# Altium schematic sheet [26] PWR 3V3, 1V0_CON.SchDoc
size 386 x 246 mm; DocumentNumber: 26; SheetNumber: 26; SheetTotal: 33
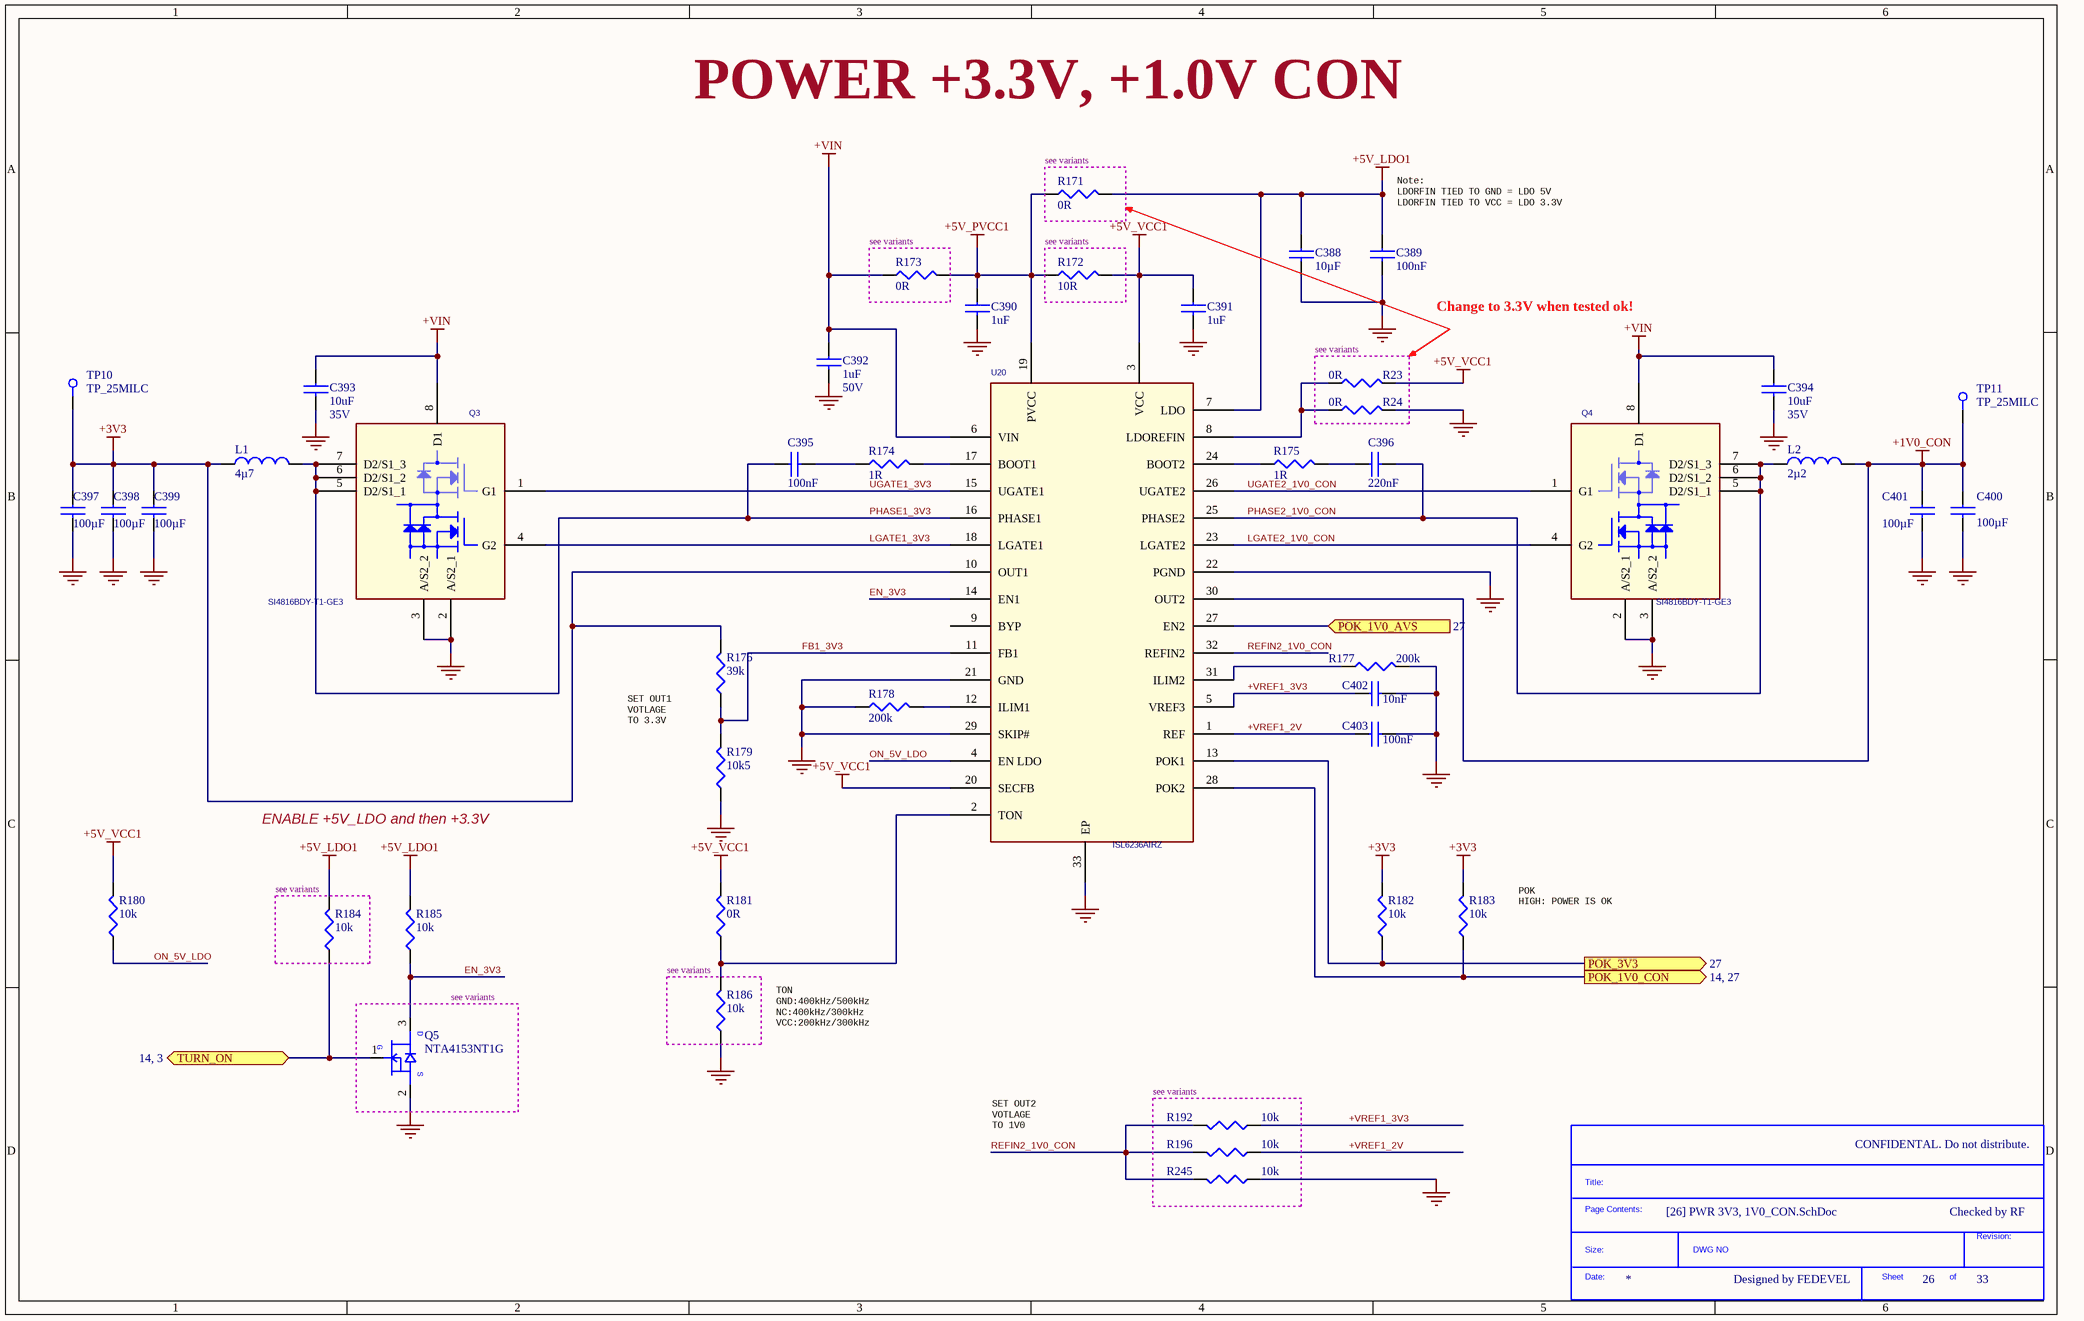
[diagram p0: [26] PWR 3V3, 1V0_CON.SchDoc]

## Parts
*  SDTitleBlock  (value not drawn)  (graphical)
C388  10µF  [C0603]
C389  100nF  [C0402]
C390  1uF  [C0402]
C391  1uF  [C0402]
C392  1uF  Voltage - Rated: 50V  [C0805]
C393  10uF  Voltage - Rated: 35V  [C1206]
C394  10uF  Voltage - Rated: 35V  [C1206]
C395  100nF  [C0402]
C396  220nF  [C0402]
C397  100µF  [C1206]
C398  100µF  [C1206]
C399  100µF  [C1206]
C400  100µF  [C1206]
C401  100µF  [C1206]
C402  10nF  [C0402]
C403  100nF  [C0402]
L1  4µ7  [IHLP_255MILx270MIL]
L2  2µ2  [IHLP_255MILx270MIL]
Q3  SI4816BDY-T1-GE3  [8_SOIC_3.9MM]
Q4  SI4816BDY-T1-GE3  [8_SOIC_3.9MM]
Q5  NTA4153NT1G  [SC-75_SOT-416]
R23  0R  [R0402]
R24  0R  [R0402]
R171  0R  [R0402]
R172  10R  [R0402]
R173  0R  [R0402]
R174  1R  [R0402]
R175  1R  [R0402]
R176  39k  [R0402]
R177  200k  [R0402]
R178  200k  [R0402]
R179  10k5  [R0402]
R180  10k  [R0402]
R181  0R  [R0402]
R182  10k  [R0402]
R183  10k  [R0402]
R184  10k  [R0402]
R185  10k  [R0402]
R186  10k  [R0402]
R192  10k  [R0402]
R196  10k  [R0402]
R245  10k  [R0402]
TP10  TP_25MILC  [TP_25C]  (no BOM)
TP11  TP_25MILC  [TP_25C]  (no BOM)
U20  ISL6236AIRZ  [32_VFQFN_EXPOSED_PAD]

## Blocks framed on the sheet
see variants: R171
see variants: R173
see variants: R172
see variants: R23 R24
see variants: R184
see variants: Q5
see variants: R186
see variants: R192 R196 R245

## Ports
POK_1V0_AVS (in, see 27), POK_1V0_CON (out, see 14, 27), POK_3V3 (out, see 27), TURN_ON (see 14, 3)

## Nets
+1V0_CON: C400.1 C401.1 L2.2 TP11.1 U20.30(OUT2)
+3V3: C397.1 C398.1 C399.1 L1.1 R176.2 R182.2 R183.2 TP10.1 U20.10(OUT1)
+5V_LDO1: C388.1 C389.1 R171.2 R184.2 R185.2 U20.7(LDO)
+5V_PVCC1: C390.1 R171.1 R172.1 R173.2 U20.19(PVCC)
+5V_VCC1: C391.1 R23.2 R172.2 R180.2 R181.2 U20.3(VCC) U20.20(SECFB)
+VIN: C392.1 C393.1 C394.1 Q3.8(D1) Q4.8(D1) R173.1 U20.6(VIN)
GND: C388.2 C389.2 C390.2 C391.2 C392.2 C393.2 C394.2 C397.2 C398.2 C399.2 C400.2 C401.2 C402.2 C403.2 Q3.2(A/S2_1) Q3.3(A/S2_2) Q4.2(A/S2_1) Q4.3(A/S2_2) Q5.2(SOURCE) R24.2 R177.2 R178.1 R179.1 R186.1 R245.1 U20.21(GND) U20.22(PGND) U20.29(SKIP#) U20.33(EP)
+VREF1_2V: C403.1 R196.1 U20.1(REF)
+VREF1_3V3: C402.1 R192.1 U20.5(VREF3)
EN_3V3: Q5.3(DRAIN) R185.1 U20.14(EN1)
FB1_3V3: R176.1 R179.2 U20.11(FB1)
LGATE1_3V3: Q3.4(G2) U20.18(LGATE1)
LGATE2_1V0_CON: Q4.4(G2) U20.23(LGATE2)
ON_5V_LDO: R180.1 U20.4(EN_LDO)
PHASE1_3V3: C395.1 L1.2 Q3.5(D2/S1_1) Q3.6(D2/S1_2) Q3.7(D2/S1_3) U20.16(PHASE1)
PHASE2_1V0_CON: C396.2 L2.1 Q4.5(D2/S1_1) Q4.6(D2/S1_2) Q4.7(D2/S1_3) U20.25(PHASE2)
POK_1V0_AVS: U20.27(EN2) ; port POK_1V0_AVS
POK_1V0_CON: R183.1 U20.28(POK2) ; port POK_1V0_CON
POK_3V3: R182.1 U20.13(POK1) ; port POK_3V3
REFIN2_1V0_CON: R192.2 R196.2 R245.2 U20.32(REFIN2)
TURN_ON: Q5.1(GATE) R184.1 ; port TURN_ON
UGATE1_3V3: Q3.1(G1) U20.15(UGATE1)
UGATE2_1V0_CON: Q4.1(G1) U20.26(UGATE2)
NetC395_2: C395.2 R174.1
NetC396_1: C396.1 R175.2
NetR23_1: R23.1 R24.1 U20.8(LDOREFIN)
NetR174_2: R174.2 U20.17(BOOT1)
NetR175_1: R175.1 U20.24(BOOT2)
NetR177_1: R177.1 U20.31(ILIM2)
NetR178_2: R178.2 U20.12(ILIM1)
NetR181_1: R181.1 R186.2 U20.2(TON)

Not connected (* = marked no-connect by the designer): U20 9(BYP)

## Notes on the sheet
- POWER +3.3V, +1.0V CON
- (near C389) Note:
  LDORFIN TIED TO GND = LDO 5V
  LDORFIN TIED TO VCC = LDO 3.3V
- Change to 3.3V when tested ok!
- SET OUT1
  VOTLAGE
  TO 3.3V
- ENABLE +5V_LDO and then +3.3V
- POK
  HIGH: POWER IS OK
- TON
  GND:400kHz/500kHz
  NC:400kHz/300kHz
  VCC:200kHz/300kHz
- SET OUT2
  VOTLAGE
  TO 1V0
- CONFIDENTAL. Do not distribute.
- Checked by RF
- Designed by FEDEVEL
- (in symbol NTA4153NT1G) D; G; S
- (in symbol SDTitleBlock) Title:; Page Contents:; Revision:; Size:; DWG NO; Date:; Sheet; of

## Library data of the parts
C388 = C1608X5R0J106M: CAP CER 10UF 6.3V X5R 20% 0603; Manufacturer: TDK Corporation; .Checked PCB: used; Description: CAP CER 10UF 6.3V 20% X5R 0603; Capacitance: 10µF; Category: Capacitors; Manufacturer Part Number: C1608X5R0J106M; Operating Temperature: -55°C ~ 85°C; Package / Case: 0603 (1608 Metric); Price 1k [$]: 0.08580; Value: 10µF; .Checked SCH: used; Voltage - Rated: 6.3V; Features: Low ESR; Supplier Part Number: 445-4112-1-ND; Supplier: Digikey; Supplier 1: Digi-Key; Supplier Part Number 1: 445-4112-1-ND; RoHS: RoHS Compliant; Stock 1: 48157; Pricing 1: 1=0.46, 10=0.363, 100=0.1898, 250=0.14024, 500=0.1089, 1000=0.0858 (USD); Tolerance: ±20%; Temperature Coefficient: X5R; Mounting Type: Surface Mount, MLCC; Applications: General Purpose; Ratings: -; Size / Dimension: 0.063" L x 0.031" W (1.60mm x 0.80mm); Height - Seated (Max): -; Thickness (Max): 0.037" (0.95mm); Lead Spacing: -; Packaging: Cut Tape (CT); Lead Style: -; ComponentLink1URL: http://www.tdk.com/pdf/general_B11.pdf; ComponentLink1Description: http://www.tdk.com/pdf/general_B11.pdf
C389 C395 C403 = C1005X5R1H104K: CAP CER .10UF 50V X5R 10% 0402; Manufacturer: TDK Corporation; Capacitance: 0.1µF; .Checked PCB: used; Description: CAP CER 0.1UF 50V 10% X5R 0402; Category: Capacitors; Manufacturer Part Number: C1005X5R1H104K; Operating Temperature: -55°C ~ 85°C; Package / Case: 0402 (1005 Metric); Price 1k [$]: 0.02340; Value: 100nF; .Checked SCH: used; Voltage - Rated: 50V; Supplier Part Number: 445-5942-1-ND; Supplier: Digikey; Supplier 1: Digi-Key; Supplier Part Number 1: 445-5942-1-ND; RoHS: RoHS Compliant; Stock 1: 106926; Pricing 1: 1=0.27, 10=0.18, 100=0.072, 250=0.05176, 500=0.0369, 1000=0.027 (USD); Tolerance: ±10%; Temperature Coefficient: X5R; Mounting Type: Surface Mount, MLCC; Applications: General Purpose; Ratings: -; Size / Dimension: 0.039" L x 0.020" W (1.00mm x 0.50mm); Height - Seated (Max): -; Thickness (Max): 0.022" (0.55mm); Lead Spacing: -; Features: -; Packaging: Cut Tape (CT); Lead Style: -; ComponentLink1URL: http://www.tdk.co.jp/tefe02/e412_c.pdf; ComponentLink1Description: http://www.tdk.co.jp/tefe02/e412_c.pdf
C390 C391 = C1005X5R1C105K: CAP CER 1.0UF 16V X5R 0402; Manufacturer: TDK Corporation; Capacitance: 1.0µF; .Checked PCB: used; Description: CAP CER 1UF 16V 10% X5R 0402; Tolerance: ±10%; Category: Capacitors; Manufacturer Part Number: C1005X5R1C105K; Operating Temperature: -55°C ~ 85°C; Package / Case: 0402 (1005 Metric); Price 1k [$]: 0.02080; Value: 1uF; .Checked SCH: used; Voltage - Rated: 16V; Supplier Part Number: 445-4978-1-ND; Supplier: Digikey; Supplier 1: Digi-Key; Supplier Part Number 1: 445-4978-1-ND; RoHS: RoHS Compliant; Stock 1: 341010; Pricing 1: 1=0.24, 10=0.16, 100=0.064, 250=0.046, 500=0.0328, 1000=0.024 (USD); Temperature Coefficient: X5R; Mounting Type: Surface Mount, MLCC; Applications: General Purpose; Ratings: -; Size / Dimension: 0.039" L x 0.020" W (1.00mm x 0.50mm); Height - Seated (Max): -; Thickness (Max): 0.022" (0.55mm); Lead Spacing: -; Features: -; Packaging: Cut Tape (CT); Lead Style: -; ComponentLink1URL: http://www.tdk.co.jp/tefe02/e412_c.pdf; ComponentLink1Description: http://www.tdk.co.jp/tefe02/e412_c.pdf
C392 = GRM21BR71H105KA12L: CAP CER 1UF 50V X7R 0805; Manufacturer: Murata Electronics North America; Capacitance: 1.0µF; .Checked PCB: used; Description: CAP CER 1UF 50V 10% X7R 0805; Tolerance: ±10%; Category: Capacitors; Manufacturer Part Number: GRM21BR71H105KA12L; Operating Temperature: -55°C ~ 125°C; Package / Case: 0805 (2012 Metric); Price 1k [$]: 0.1359; Value: 1uF; .Checked SCH: used; Supplier Part Number: 490-4736-1-ND; Supplier: Digikey; Supplier 1: Digi-Key; Supplier Part Number 1: 490-4736-1-ND; RoHS: RoHS Compliant; Stock 1: 422791; Pricing 1: 1=0.28, 10=0.254, 25=0.226, 50=0.1978, 100=0.1836, 250=0.16952, 500=0.16102, 750=0.14691, 1000=0.12995 (USD); Temperature Coefficient: X7R; Mounting Type: Surface Mount, MLCC; Applications: General Purpose; Ratings: -; Size / Dimension: 0.079" L x 0.049" W (2.00mm x 1.25mm); Height - Seated (Max): -; Thickness (Max): 0.053" (1.35mm); Lead Spacing: -; Features: -; Packaging: Cut Tape (CT); Lead Style: -; ComponentLink1URL: http://search.murata.co.jp/Ceramy/image/img/PDF/ENG/GRM21BR71H105KA12.pdf; ComponentLink1Description: http://search.murata.co.jp/Ceramy/image/img/PDF/ENG/GRM21BR71H105KA12.pdf
C393 C394 = GRM31CR6YA106KA12L: CAP CER 10UF 35V X5R 1206; Manufacturer: Murata Electronics North America; Capacitance: 10µF; .Checked PCB: used; Description: CAP CER 10UF 35V 10% X5R 1206; Tolerance: ±10%; Category: Capacitors; Manufacturer Part Number: GRM31CR6YA106KA12L; Operating Temperature: -55°C ~ 85°C; Package / Case: 1206 (3216 Metric); Price 1k [$]: 0.19448; Value: 10uF; .Checked SCH: used; Supplier Part Number: 490-5524-1-ND; Supplier: Digikey; Supplier 1: Digi-Key; Supplier Part Number 1: 490-5524-1-ND; RoHS: RoHS Compliant; Stock 1: 76334; Pricing 1: 1=0.6, 10=0.501, 50=0.359, 100=0.3142, 250=0.24684, 500=0.2244, 1000=0.17952 (USD); Temperature Coefficient: X5R; Mounting Type: Surface Mount, MLCC; Applications: General Purpose; Ratings: -; Size / Dimension: 0.126" L x 0.063" W (3.20mm x 1.60mm); Height - Seated (Max): -; Thickness (Max): 0.071" (1.80mm); Lead Spacing: -; Features: -; Packaging: Cut Tape (CT); Lead Style: -; ComponentLink1URL: http://www.murata.com/products/catalog/pdf/c02e.pdf; ComponentLink1Description: http://www.murata.com/products/catalog/pdf/c02e.pdf
C396 = C1005X5R1E224M: CAP CER .22UF 25V X5R 20% 0402; Manufacturer: TDK Corporation; Capacitance: 0.22µF; .Checked PCB: used; Description: CAP CER 0.22UF 25V 20% X5R 0402; Category: Capacitors; Manufacturer Part Number: C1005X5R1E224M; Operating Temperature: -55°C ~ 85°C; Package / Case: 0402 (1005 Metric); Price 1k [$]: 0.02600; Value: 220nF; .Checked SCH: used; Voltage - Rated: 25V; Supplier Part Number: 445-5945-1-ND; Supplier: Digikey; Supplier 1: Digi-Key; Supplier Part Number 1: 445-5945-1-ND; RoHS: RoHS Compliant; Stock 1: 54593; Pricing 1: 1=0.3, 10=0.2, 100=0.08, 250=0.05752, 500=0.041, 1000=0.03 (USD); Tolerance: ±20%; Temperature Coefficient: X5R; Mounting Type: Surface Mount, MLCC; Applications: General Purpose; Ratings: -; Size / Dimension: 0.039" L x 0.020" W (1.00mm x 0.50mm); Height - Seated (Max): -; Thickness (Max): 0.022" (0.55mm); Lead Spacing: -; Features: -; Packaging: Cut Tape (CT); Lead Style: -; ComponentLink1URL: http://www.tdk.co.jp/tefe02/e412_c.pdf; ComponentLink1Description: http://www.tdk.co.jp/tefe02/e412_c.pdf
C397-C401 = C3216X5R1A107M: CAP CER 100UF 10V X5R 20% 1206; Manufacturer: TDK Corporation; .Checked PCB: used; Description: CAP CER 100UF 10V 20% X5R 1206; Capacitance: 100µF; Category: Capacitors; Manufacturer Part Number: C3216X5R1A107M; Operating Temperature: -55°C ~ 85°C; Package / Case: 1206 (3216 Metric); Price 1k [$]: 0.85800; Value: 100µF; .Checked SCH: used; Voltage - Rated: 10V; Supplier Part Number: 445-6007-1-ND; Supplier: Digikey; Supplier 1: Digi-Key; Supplier Part Number 1: 445-6007-1-ND; RoHS: RoHS Compliant; Stock 1: 28026; Pricing 1: 1=1.65, 10=1.353, 100=1.089, 250=0.957, 500=0.891, 1000=0.693 (USD); Tolerance: ±20%; Temperature Coefficient: X5R; Mounting Type: Surface Mount, MLCC; Applications: General Purpose; Ratings: -; Size / Dimension: 0.126" L x 0.063" W (3.20mm x 1.60mm); Height - Seated (Max): -; Thickness (Max): 0.071" (1.80mm); Lead Spacing: -; Features: -; Packaging: Cut Tape (CT); Lead Style: -; ComponentLink1URL: http://www.tdk.com/pdf/general_B11.pdf; ComponentLink1Description: http://www.tdk.com/pdf/general_B11.pdf
C402 = C1005X7R1C103K: CAP CER 10000PF 16V X7R 10% 0402; Manufacturer: TDK Corporation; .Checked PCB: used; Description: CAP CER 10000PF 16V 10% X7R 0402; Capacitance: 10000pF; Category: Capacitors; Manufacturer Part Number: C1005X7R1C103K; Operating Temperature: -55°C ~ 125°C; Package / Case: 0402 (1005 Metric); Price 1k [$]: 0.00416; Value: 10nF; .Checked SCH: used; Voltage - Rated: 16V; Supplier Part Number: 445-1262-1-ND; Supplier: Digikey; Supplier 1: Digi-Key; Supplier Part Number 1: 445-1262-1-ND; RoHS: RoHS Compliant; Stock 1: 511497; Pricing 1: 1=0.08, 10=0.05, 100=0.018, 250=0.013, 500=0.0096, 1000=0.0065 (USD); Tolerance: ±10%; Temperature Coefficient: X7R; Mounting Type: Surface Mount, MLCC; Applications: General Purpose; Ratings: -; Size / Dimension: 0.039" L x 0.020" W (1.00mm x 0.50mm); Height - Seated (Max): -; Thickness (Max): 0.022" (0.55mm); Lead Spacing: -; Features: -; Packaging: Cut Tape (CT); Lead Style: -; ComponentLink1URL: http://www.tdk.co.jp/tefe02/e412_c.pdf; ComponentLink1Description: http://www.tdk.co.jp/tefe02/e412_c.pdf
L1 = IHLP2525CZER4R7M01: INDUCTOR POWER 4.7UH 5.5A SMD; Manufacturer: Vishay/Dale; .Checked PCB: used; Inductance: 4.7µH; Current - Saturation: 10A; Shielding: Shielded; DC Resistance (DCR): 40 mOhm Max; Tolerance: ±20%; Frequency - Test: 100kHz; .Checked SCH: used; Category: Inductors, Coils, Chokes; Manufacturer Part Number: IHLP2525CZER4R7M01; Operating Temperature: -55°C ~ 125°C; Package / Case: 0.270" L x 0.255" W x 0.118" H (6.86mm x 6.47mm x 3.00mm); Price 1k [$]: 1.09800; Value: 4µ7; Current: 5.5A; Applications: General Purpose; Supplier Part Number: 541-1010-1-ND; Supplier: Digikey; Supplier 1: Digi-Key; Supplier Part Number 1: 541-1010-1-ND; RoHS: RoHS Compliant; Stock 1: 25684; Pricing 1: 1=2.26, 10=1.83, 100=1.525, 500=1.22, 1000=1.098 (USD); Current - Temperature Rise: 5.5A; Type: -; Q @ Freq: -; Frequency - Self Resonant: -; Material - Core: -; Mounting Type: Surface Mount; Packaging: Cut Tape (CT); ComponentLink1URL: http://www.vishay.com/doc?34104; ComponentLink1Description: http://www.vishay.com/doc?34104
L2 = IHLP2525CZER2R2M01: INDUCTOR POWER 2.2UH 8A SMD; Manufacturer: Vishay/Dale; .Checked PCB: used; Inductance: 2.2µH; Current - Saturation: 14A; Shielding: Shielded; DC Resistance (DCR): 20 mOhm Max; Tolerance: ±20%; Frequency - Test: 100kHz; .Checked SCH: used; Category: Inductors, Coils, Chokes; Manufacturer Part Number: IHLP2525CZER2R2M01; Operating Temperature: -55°C ~ 125°C; Package / Case: 0.270" L x 0.255" W x 0.118" H (6.86mm x 6.47mm x 3.00mm); Price 1k [$]: 1.09800; Value: 2µ2; Current: 8A; Applications: General Purpose; Supplier Part Number: 541-1008-1-ND; Supplier: Digikey; Supplier 1: Digi-Key; Supplier Part Number 1: 541-1008-1-ND; RoHS: RoHS Compliant; Stock 1: 17960; Pricing 1: 1=2.26, 10=1.83, 100=1.525, 500=1.22, 1000=1.098 (USD); Current - Temperature Rise: 8A; Type: -; Q @ Freq: -; Frequency - Self Resonant: -; Material - Core: -; Mounting Type: Surface Mount; Packaging: Cut Tape (CT); ComponentLink1URL: http://www.vishay.com/doc?34104; ComponentLink1Description: http://www.vishay.com/doc?34104
Q3 Q4 = SI4816BDY-T1-GE3: MOSFET DL N-CH 30V 6.8A 8-SOIC; Manufacturer: Vishay/Siliconix; .Checked PCB: used; FET Type: 2 N-Channel (Dual); FET Feature: Logic Level Gate; Rds On (Max) @ Id, Vgs: 18.5 mOhm @ 6.8A, 10V; Current - Continuous Drain (Id) @ 25° C: 5.8A, 8.2A; Vgs(th) (Max) @ Id: 3V @ 250µA; Power - Max: 1W, 1.25W; Gate Charge (Qg) @ Vgs: 10nC @ 5V; .Checked SCH: used; Category: Discrete Semiconductor Products; Manufacturer Part Number: SI4816BDY-T1-GE3; Package / Case: 8-SOIC (0.154", 3.90mm Width); Price 1k [$]: 0.84800; Value: SI4816BDY-T1-GE3; Family: FETs - Arrays; Drain to Source Voltage (Vdss): 30V; Supplier Part Number: SI4816BDY-T1-GE3CT-ND; Supplier: Digikey; Supplier 1: Digi-Key; Supplier Part Number 1: SI4816BDY-T1-GE3CT-ND; RoHS: RoHS Compliant; Stock 1: 15735; Pricing 1: 1=1.84, 25=1.4228, 100=1.2912, 250=1.1594, 500=1.0013, 1000=0.8432 (USD); Input Capacitance (Ciss) @ Vds: -; Mounting Type: Surface Mount; Supplier Device Package: 8-SOICN; Packaging: Cut Tape (CT); ComponentLink1URL: http://www.vishay.com/docs/73026/si4816bd.pdf; ComponentLink1Description: http://www.vishay.com/docs/73026/si4816bd.pdf
Q5 = NTA4153NT1G: MOSFET N-CH 20V 915MA SOT-416; Manufacturer: ON Semiconductor; .Checked PCB: used; FET Type: MOSFET N-Channel, Metal Oxide; FET Feature: Logic Level Gate; Rds On (Max) @ Id, Vgs: 230 mOhm @ 600mA, 4.5V; Vgs(th) (Max) @ Id: 1.1V @ 250µA; Power - Max: 300mW; Gate Charge (Qg) @ Vgs: 1.82nC @ 4.5V; Input Capacitance (Ciss) @ Vds: 110pF @ 16V; .Checked SCH: used; Category: Discrete Semiconductor Products; Family: FETs - Single; Manufacturer Part Number: NTA4153NT1G; Package / Case: SC-75-3, SOT-416; Price 1k [$]: 0.14710; Value: NTA4153NT1G; Drain to Source Voltage (Vdss): 20V; Current - Continuous Drain (Id) @ 25° C: 915mA; Supplier Part Number: NTA4153NT1GOSCT-ND; Supplier: Digikey; Supplier 1: Digi-Key; Supplier Part Number 1: NTA4153NT1GOSCT-ND; RoHS: RoHS Compliant; Stock 1: 35742; Pricing 1: 1=0.51, 25=0.3312, 100=0.2721, 250=0.22672, 500=0.18836, 1000=0.13952 (USD); Mounting Type: Surface Mount; Supplier Device Package: SC-75; Packaging: Cut Tape (CT); ComponentLink1URL: http://www.onsemi.com/pub_link/Collateral/NTA4153N-D.PDF; ComponentLink1Description: http://www.onsemi.com/pub_link/Collateral/NTA4153N-D.PDF
R23 R24 R171 R173 R181 = RC0402JR-070RL: RES 0.0 OHM 1/16W 0402 SMD; Manufacturer: Yageo; Resistance (Ohms): 0.0; Power (Watts): 0.063W, 1/16W; Tolerance: Jumper; .Checked PCB: used; Category: Resistors; Supplier Part Number: 311-0.0JRCT-ND; Manufacturer Part Number: RC0402JR-070RL; Package / Case: 0402 (1005 Metric); Price 1k [$]: 0.01389; Value: 0R; .Checked SCH: used; Supplier: Digikey; Supplier 1: Digi-Key; Supplier Part Number 1: 311-0.0JRCT-ND; RoHS: RoHS Compliant; Stock 1: 1106330; Pricing 1: 10=0.012, 50=0.009, 100=0.0069, 250=0.00512, 500=0.0038, 1000=0.00253 (USD); Composition: Thick Film; Features: -; Temperature Coefficient: -; Size / Dimension: 0.039" L x 0.020" W (1.00mm x 0.50mm); Height: 0.016" (0.40mm); Number of Terminations: 2; Packaging: Cut Tape (CT); ComponentLink1URL: http://www.yageo.com/documents/recent/PYu-RC0402_51_RoHS_L_6.pdf; ComponentLink1Description: http://www.yageo.com/documents/recent/PYu-RC0402_51_RoHS_L_6.pdf
R172 = RC0402FR-0710RL: RES 10.0 OHM 1/16W 1% 0402 SMD; Manufacturer: Yageo; Resistance (Ohms): 10; Power (Watts): 0.063W, 1/16W; .Checked PCB: used; Temperature Coefficient: ±200ppm/°C; Category: Resistors; Manufacturer Part Number: RC0402FR-0710RL; Package / Case: 0402 (1005 Metric); Price 1k [$]: 0.01421; Tolerance: ±1%; Value: 10R; .Checked SCH: used; Supplier Part Number: 311-10.0LRCT-ND; Supplier: Digikey; Supplier 1: Digi-Key; Supplier Part Number 1: 311-10.0LRCT-ND; RoHS: RoHS Compliant; Stock 1: 681416; Pricing 1: 10=0.014, 50=0.0104, 100=0.0079, 250=0.00584, 500=0.00432, 1000=0.00288 (USD); Composition: Thick Film; Features: -; Size / Dimension: 0.039" L x 0.020" W (1.00mm x 0.50mm); Height: 0.016" (0.40mm); Number of Terminations: 2; Packaging: Cut Tape (CT); ComponentLink1URL: http://www.yageo.com/documents/recent/PYu-RC0402_51_RoHS_L_6.pdf; ComponentLink1Description: http://www.yageo.com/documents/recent/PYu-RC0402_51_RoHS_L_6.pdf
R174 R175 = RC0402FR-071RL: RES 1.00 OHM 1/16W 1% 0402 SM; Manufacturer: Yageo; Resistance (Ohms): 1; Power (Watts): 0.063W, 1/16W; .Checked PCB: used; Description: RES 1.00 OHM 1/16W 1% 0402 SMD; Temperature Coefficient: ±200ppm/°C; Category: Resistors; Manufacturer Part Number: RC0402FR-071RL; Package / Case: 0402 (1005 Metric); Price 1k [$]: 0.01421; Tolerance: ±1%; Value: 1R; .Checked SCH: used; Supplier Part Number: 311-1.00LRCT-ND; Supplier: Digikey; Supplier 1: Digi-Key; Supplier Part Number 1: 311-1.00LRCT-ND; RoHS: RoHS Compliant; Stock 1: 347765; Pricing 1: 10=0.019, 50=0.0142, 100=0.0109, 250=0.00808, 500=0.00596, 1000=0.00397 (USD); Composition: Thick Film; Features: -; Size / Dimension: 0.039" L x 0.020" W (1.00mm x 0.50mm); Height: 0.016" (0.40mm); Number of Terminations: 2; Packaging: Cut Tape (CT); ComponentLink1URL: http://www.yageo.com/documents/recent/PYu-RC0402_51_RoHS_L_6.pdf; ComponentLink1Description: http://www.yageo.com/documents/recent/PYu-RC0402_51_RoHS_L_6.pdf
R176 = RC0402FR-0739KL: RES 39.0K OHM 1/16W 1% 0402 SMD; Manufacturer: Yageo; Power (Watts): 0.063W, 1/16W; .Checked PCB: used; Temperature Coefficient: ±100ppm/°C; Category: Resistors; Manufacturer Part Number: RC0402FR-0739KL; Package / Case: 0402 (1005 Metric); Price 1k [$]: 0.01421; Resistance (Ohms): 39K; Tolerance: ±1%; Value: 39k; .Checked SCH: used; Supplier Part Number: 311-39.0KLRCT-ND; Supplier: Digikey; Supplier 1: Digi-Key; Supplier Part Number 1: 311-39.0KLRCT-ND; RoHS: RoHS Compliant; Stock 1: 36775; Pricing 1: 10=0.014, 50=0.0104, 100=0.0079, 250=0.00584, 500=0.00432, 1000=0.00288 (USD); Composition: Thick Film; Features: -; Size / Dimension: 0.039" L x 0.020" W (1.00mm x 0.50mm); Height: 0.016" (0.40mm); Number of Terminations: 2; Packaging: Cut Tape (CT); ComponentLink1URL: http://www.yageo.com/documents/recent/PYu-RC0402_51_RoHS_L_6.pdf; ComponentLink1Description: http://www.yageo.com/documents/recent/PYu-RC0402_51_RoHS_L_6.pdf
R177 R178 = RC0402FR-07200KL: RES 200K OHM 1/16W 1% 0402 SMD; Manufacturer: Yageo; Power (Watts): 0.063W, 1/16W; .Checked PCB: used; Temperature Coefficient: ±100ppm/°C; Category: Resistors; Manufacturer Part Number: RC0402FR-07200KL; Package / Case: 0402 (1005 Metric); Price 1k [$]: 0.01421; Resistance (Ohms): 200K; Tolerance: ±1%; Value: 200k; .Checked SCH: used; Supplier Part Number: 311-200KLRCT-ND; Supplier: Digikey; Supplier 1: Digi-Key; Supplier Part Number 1: 311-200KLRCT-ND; RoHS: RoHS Compliant; Stock 1: 225869; Pricing 1: 10=0.014, 50=0.0104, 100=0.0079, 250=0.00584, 500=0.00432, 1000=0.00288 (USD); Composition: Thick Film; Features: -; Size / Dimension: 0.039" L x 0.020" W (1.00mm x 0.50mm); Height: 0.016" (0.40mm); Number of Terminations: 2; Packaging: Cut Tape (CT); ComponentLink1URL: http://www.yageo.com/documents/recent/PYu-RC0402_51_RoHS_L_6.pdf; ComponentLink1Description: http://www.yageo.com/documents/recent/PYu-RC0402_51_RoHS_L_6.pdf
R179 = CRCW040210K5FKED: RES 10.5K OHM 1/16W 1% 0402 SMD; Manufacturer: Vishay/Dale; Power (Watts): 0.063W, 1/16W; .Checked PCB: used; Temperature Coefficient: ±100ppm/°C; Category: Resistors; Manufacturer Part Number: CRCW040210K5FKED; Package / Case: 0402 (1005 Metric); Price 1k [$]: 0.01740; Resistance (Ohms): 10.5K; Tolerance: ±1%; Value: 10k5; .Checked SCH: used; Supplier Part Number: 541-10.5KLCT-ND; Supplier: Digikey; Supplier 1: Digi-Key; Supplier Part Number 1: 541-10.5KLCT-ND; RoHS: RoHS Compliant; Stock 1: 36157; Pricing 1: 10=0.083, 50=0.0444, 200=0.0255, 1000=0.0174 (USD); Composition: Thick Film; Features: -; Size / Dimension: 0.039" L x 0.020" W (1.00mm x 0.50mm); Height: 0.016" (0.40mm); Number of Terminations: 2; Packaging: Cut Tape (CT); ComponentLink1URL: http://www.vishay.com/doc?20035; ComponentLink1Description: http://www.vishay.com/doc?20035
R180 R182-R186 R192 R196 R245 = RC0402FR-0710KL: RES 10.0K OHM 1/16W 1% 0402 SMD; Manufacturer: Yageo; Power (Watts): 0.063W, 1/16W; .Checked PCB: used; Temperature Coefficient: ±100ppm/°C; Category: Resistors; Manufacturer Part Number: RC0402FR-0710KL; Package / Case: 0402 (1005 Metric); Price 1k [$]: 0.01421; Resistance (Ohms): 10K; Tolerance: ±1%; Value: 10k; .Checked SCH: used; Supplier Part Number: 311-10.0KLRCT-ND; Supplier: Digikey; Supplier 1: Digi-Key; Supplier Part Number 1: 311-10.0KLRCT-ND; RoHS: RoHS Compliant; Stock 1: 2916495; Pricing 1: 10=0.014, 50=0.0104, 100=0.0079, 250=0.00584, 500=0.00432, 1000=0.00288 (USD); Composition: Thick Film; Features: -; Size / Dimension: 0.039" L x 0.020" W (1.00mm x 0.50mm); Height: 0.016" (0.40mm); Number of Terminations: 2; Packaging: Cut Tape (CT); ComponentLink1URL: http://www.yageo.com/documents/recent/PYu-RC0402_51_RoHS_L_6.pdf; ComponentLink1Description: http://www.yageo.com/documents/recent/PYu-RC0402_51_RoHS_L_6.pdf
TP10 TP11 = TP_25MILC: Test Point 25mil
U20 = ISL6236AIRZ: IC MAIN PWR CTRLR QUAD 32-QFN; Manufacturer: Intersil; .Checked PCB: used; Voltage - Input: 4.5 V ~ 25 V; Number of Outputs: 4; Voltage - Output: Multiple; .Checked SCH: used; Category: Integrated Circuits (ICs); Manufacturer Part Number: ISL6236AIRZ; Operating Temperature: -40°C ~ 100°C; Package / Case: 32-VFQFN Exposed Pad; Price 1k [$]: 3.0840; Value: ISL6236AIRZ; Family: PMIC - Voltage Regulators - Special Purpose; Supplier Part Number: ISL6236AIRZ-ND; Supplier: Digikey; Supplier 1: Digi-Key; Supplier Part Number 1: ISL6236AIRZ-ND; RoHS: RoHS Compliant; Stock 1: 0; Pricing 1: 600=4.28 (USD); Applications: Controller, Notebook Power System; Mounting Type: Surface Mount; Supplier Device Package: 32-QFN Exposed Pad (5x5); Packaging: Tube; ComponentLink1URL: http://www.intersil.com/data/fn/fn6453.pdf; ComponentLink1Description: http://www.intersil.com/data/fn/fn6453.pdf